# Altium schematic sheet ГРЛМ.468332.031Э3 (Лист 1).SchDoc: Наименование
size 420 x 297 mm; ApprovedBy: Утвердил; CheckedBy: Проверил; Author: Соколов; DocumentNumber: ГРЛМ.468332.031Э3; Revision: 0; SheetNumber: 1; SheetTotal: 3; PageSetup: Record=PageOptions|CenterHorizontal=True|CenterVertical=True|PrintScale=0.94|XCorrection=1.00|YCorrection=1.00|PrintKind=1|BorderSize=5000000|LeftOffset=0|BottomOffset=0|Orientation=1|PaperLength=1000|PaperWidth=1000|Scale=100|PaperSource=7|PrintQuality=-4|MediaType=1|DitherType=10|PaperKind=A4|PrintScaleMode=1; HeadOfSector: Нач. сектора; MainDevice: Перв.примен.; n_kontr: Н. контр; t_kontr: Т. Контр; lit_A: О; Наименование изделия (строка 1): Узел печатный; Наименование изделия (строка 2): R 6 DSX 04 M; Вид документа: Схема электрическая принципиальная; ListStatus: Нов.; Перв. примен.: ГРЛМ.468332.031; FileName: ГРЛМ.468332.031Э3.pdf; DocumentName: Sheet1.SCHDOC
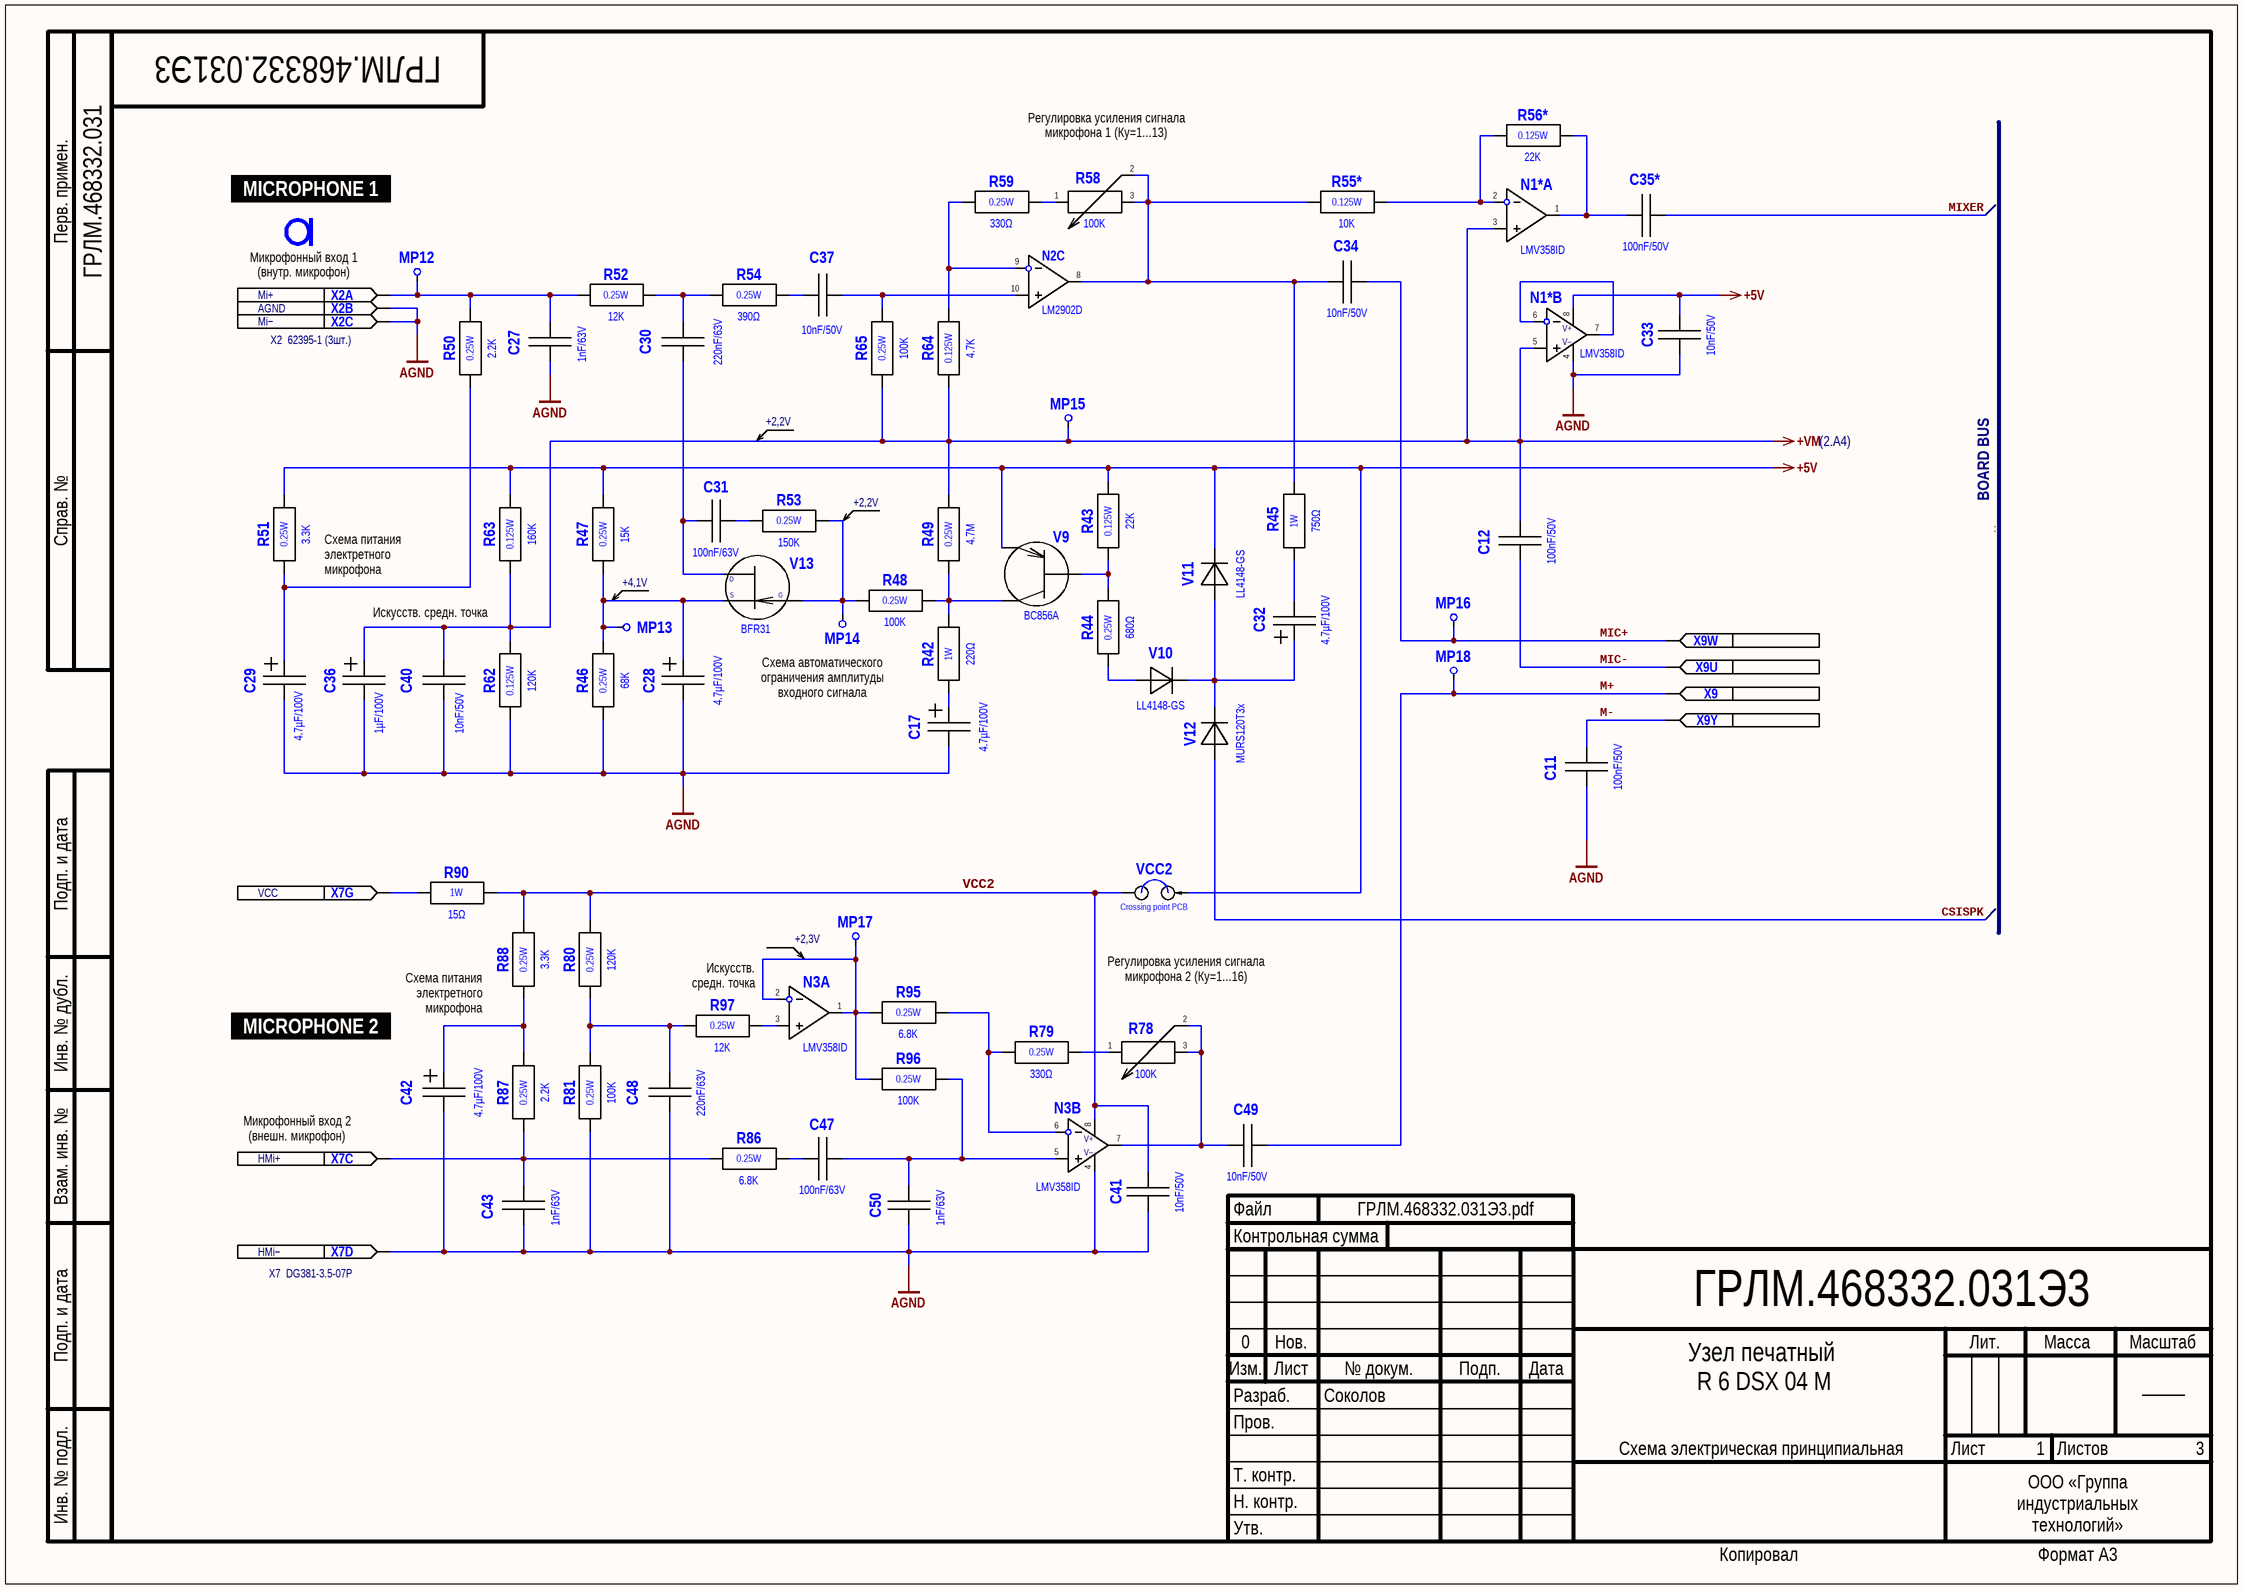
[diagram p0: ГРЛМ.468332.031Э3 (Лист 1).SchDoc]

## Parts
(Parts that share a designator on the sheet are numbered #1, #2 ... from top to bottom, then left to right.)
?#1  (no value)  (graphical)
?#2  (no value)  (graphical)
?#3  (no value)  (graphical)
?#4  (no value)  (graphical)
C11  100nF/50V  [SMD Capacitor 0805]
C12  100nF/50V  [SMD Capacitor 0805]
C17  4.7µF/100V  [Capacitor  electrolytic 5x11mm]
C27  1nF/63V  [SMD Capacitor 0805]
C28  4.7µF/100V  [Capacitor  electrolytic 5x11mm]
C29  4.7µF/100V  [Capacitor  electrolytic 5x11mm]
C30  220nF/63V  [SMD Capacitor 0805]
C31  100nF/63V  [SMD Capacitor 0805]
C32  4.7µF/100V  [Capacitor  electrolytic 5x11mm]
C33  10nF/50V  [SMD Capacitor 0805]
C34  10nF/50V  [SMD Capacitor 0805]
C35*  100nF/50V  [SMD Capacitor 0805]
C36  1µF/100V  [Capacitor  electrolytic 5x11mm]
C37  10nF/50V  [SMD Capacitor 0805]
C40  10nF/50V  [SMD Capacitor 0805]
C41  10nF/50V  [SMD Capacitor 0805]
C42  4.7µF/100V  [Capacitor  electrolytic 5x11mm]
C43  1nF/63V  [SMD Capacitor 0805]
C47  100nF/63V  [SMD Capacitor 0805]
C48  220nF/63V  [SMD Capacitor 0805]
C49  10nF/50V  [SMD Capacitor 0805]
C50  1nF/63V  [SMD Capacitor 0805]
MP12  TestPoint SMD  [Test point SMD]  (value not drawn)
MP13  TestPoint SMD  [Test point SMD]  (value not drawn)
MP14  TestPoint SMD  [Test point SMD]  (value not drawn)
MP15  TestPoint SMD  [Test point SMD]  (value not drawn)
MP16  TestPoint SMD  [Test point SMD]  (value not drawn)
MP17  TestPoint SMD  [Test point SMD]  (value not drawn)
MP18  TestPoint SMD  [Test point SMD]  (value not drawn)
N1*  LMV358ID  [SO8 (SOIC-8)]  (parts A,B of 2)
N2  LM2902D  [SO14]  (part C of 4)
N3  LMV358ID  [SO8 (SOIC-8)]  (parts A,B of 2)
R42  220Ω  Power dissipation: 1W  [Resistor FMP100 1W Yageo]
R43  22K  Power dissipation: 0.125W  [SMD Resistor 0805]
R44  680Ω  Power dissipation: 0.25W  [SMD Resistor 1206]
R45  750Ω  Power dissipation: 1W  [Resistor FMP100 1W Yageo]
R46  68K  Power dissipation: 0.25W  [SMD Resistor 1206]
R47  15K  Power dissipation: 0.25W  [SMD Resistor 1206]
R48  100K  Power dissipation: 0.25W  [SMD Resistor 1206]
R49  4.7M  Power dissipation: 0.25W  [SMD Resistor 1206]
R50  2.2K  Power dissipation: 0.25W  [SMD Resistor 1206]
R51  3.3K  Power dissipation: 0.25W  [SMD Resistor 1206]
R52  12K  Power dissipation: 0.25W  [SMD Resistor 1206]
R53  150K  Power dissipation: 0.25W  [SMD Resistor 1206]
R54  390Ω  Power dissipation: 0.25W  [SMD Resistor 1206]
R55*  10K  Power dissipation: 0.125W  [SMD Resistor 0805]
R56*  22K  Power dissipation: 0.125W  [SMD Resistor 0805]
R58  100K  [3362H Square Trimming Potentiometer]
R59  330Ω  Power dissipation: 0.25W  [SMD Resistor 1206]
R62  120K  Power dissipation: 0.125W  [SMD Resistor 0805]
R63  160K  Power dissipation: 0.125W  [SMD Resistor 0805]
R64  4.7K  Power dissipation: 0.125W  [SMD Resistor 0805]
R65  100K  Power dissipation: 0.25W  [SMD Resistor 1206]
R78  100K  [3362H Square Trimming Potentiometer]
R79  330Ω  Power dissipation: 0.25W  [SMD Resistor 1206]
R80  120K  Power dissipation: 0.25W  [SMD Resistor 1206]
R81  100K  Power dissipation: 0.25W  [SMD Resistor 1206]
R86  6.8K  Power dissipation: 0.25W  [SMD Resistor 1206]
R87  2.2K  Power dissipation: 0.25W  [SMD Resistor 1206]
R88  3.3K  Power dissipation: 0.25W  [SMD Resistor 1206]
R90  15Ω  Power dissipation: 1W  [Resistor FMP100 1W Yageo]
R95  6.8K  Power dissipation: 0.25W  [SMD Resistor 1206]
R96  100K  Power dissipation: 0.25W  [SMD Resistor 1206]
R97  12K  Power dissipation: 0.25W  [SMD Resistor 1206]
V9  BC856A  [Transistor BC856 SOT23 (PNP transistor)]
V10  LL4148-GS  [Diode SOD80C (Anode pin 1)]
V11  LL4148-GS  [Diode SOD80C (Anode pin 1)]
V12  MURS120T3x  [Diode SMB (DO-214AA)]
V13  BFR31  [Transistor BFR31 SOT23 (FET N-channel)]
VCC2  Crossing point PCB  [Crossing point PCB]
X2  62395-1 (3ps)  [Faston Connector 3 x 2.8 mm]  (value not drawn)  (parts A,B,C of 3)
X7  DG381-3.5-07P  [DG381-3.5-07P Terminals]  (value not drawn)  (parts C,D,G of 7)
X9  5177983-2  [Connector 5177983-2]  (value not drawn)  (parts U,W,Y,27 of 60)

## Nets
+5V: C33.2 N1*.8 R43.2 R47.2 R51.2 R63.2 V9.2(Emitter) V11.2 VCC2.1
+VM: C12.2 C36.1 C40.2 MP15.1 N1*.3 N1*.5 R49.2 R62.2 R63.1 R64.1 R65.1
AGND: C11.1 C17.2 C27.1 C28.2 C29.2 C33.1 C36.2 C40.1 C41.1 C42.2 C43.1 C48.1 C50.1 N1*.4 N3.4 R46.1 R62.1 R81.1 X2.2 X2.3 X7.4
CSISPK: V12.1
M+: C49.2 MP18.1 X9.27
M-: C11.2 X9.25
MIC+: C34.2 MP16.1 X9.23
MIC-: C12.1 X9.21
MIXER: C35*.2
VCC2: C41.2 N3.8 R80.2 R88.2 R90.2 VCC2.2
NetC17_1: C17.1 R42.1
NetC27_2: C27.2 MP12.1 R50.2 R52.1 X2.1
NetC28_1: C28.1 MP13.1 R46.2 R47.1 V13.2(Source)
NetC29_1: C29.1 R50.1 R51.1
NetC30_1: C30.1 C31.2 V13.1(Drain)
NetC30_2: C30.2 R52.2 R54.1
NetC31_1: C31.1 R53.1
NetC32_1: C32.1 V10.2 V11.1 V12.2
NetC32_2: C32.2 R45.2
NetC34_1: C34.1 N2.8 R45.1 R55*.1 R58.2 R58.3
NetC35*_1: C35*.1 N1*.1 R56*.2
NetC37_1: C37.1 R54.2
NetC37_2: C37.2 N2.10 R65.2
NetC42_1: C42.1 R87.2 R88.1
NetC43_2: C43.2 R86.1 R87.1 X7.3
NetC47_1: C47.1 C50.2 N3.5 R96.2
NetC47_2: C47.2 R86.2
NetC48_2: C48.2 R80.1 R81.2 R97.1
NetC49_1: C49.1 N3.7 R78.2 R78.3
NetMP14_1: MP14.1 R48.1 R53.2 V13.3(Gate)
NetMP17_1: MP17.1 N3.1 N3.2 R95.1 R96.1
NetN1*_2: N1*.2 R55*.2 R56*.1
NetN1*_6: N1*.6 N1*.7
NetN2_9: N2.9 R59.1 R64.2
NetN3_3: N3.3 R97.2
NetN3_6: N3.6 R79.1 R95.2
NetR42_2: R42.2 R48.2 R49.1 V9.3(Collector)
NetR43_1: R43.1 R44.2 V9.1(Base)
NetR44_1: R44.1 V10.1
NetR58_1: R58.1 R59.2
NetR78_1: R78.1 R79.2
NetR90_1: R90.1 X7.7

## Buses and harness runs
bus ..

## Notes on the sheet
- (near R58) Регулировка усиления сигнала микрофона 1 (Ку=1...13)
- MICROPHONE 1
- (near X2) Микрофонный вход 1
  (внутр. микрофон)
- Mi+
- AGND
- Mi−
- (near X2) X2  62395-1 (3шт.)
- +2,2V
- (2.A4)
- BOARD BUS
- (near R53) +2,2V
- (near R51) Схема питания электретного микрофона
- +4,1V
- Искусств. средн. точка
- Схема автоматического ограничения амплитуды входного сигнала
- VCC
- Искусств.
  средн. точка
- +2,3V
- MICROPHONE 2
- Схема питания электретного микрофона
- (near R78) Регулировка усиления сигнала микрофона 2 (Ку=1...16)
- (near X7) Микрофонный вход 2
  (внешн. микрофон)
- HMi+
- HMi−
- (near X7) X7  DG381-3.5-07P
- Перв. примен.
- Справ. №
- Подп. и дата
- Инв. № дубл.
- Взам. инв. №
- Файл
- Контрольная сумма
- Лит.
- Масса
- Масштаб
- Разраб.
- Изм.
- Лист
- № докум.
- Подп.
- Дата
- Инв. № подл.
- Пров.
- Т. контр.
- Листов
- Н. контр.
- Утв.
- ООО «Группа индустриальных технологий»
- Копировал
- Формат А3
- (in symbol LMV358D, part B) V+; V–
- (in symbol Transistor FET N-channel) D; S; G

## Library data of the parts
?#1 = Штамп с развернутым обозначением документа
?#2 = Штамп с применяемостью
?#3 = Левый нижний угловой штамп
?#4 = Основная надпись первого листа
C11 C12 C35* = Capacitor: Partnumber: CC0805KRX7R9BB104; Vendor: Yageo; Type: Конденсатор керамический 100 нФ 5% 50В SMD 0805
C17 C28 C29 C32 C42 = Capacitor Electrolytic: Partnumber: К50-35-100В-4,7мкФ 5х11мм; Type: Конденсатор электролитический 4,7 мкФ ±20% 100В
C27 C43 C50 = Capacitor: Partnumber: CC0805JRNPO0BN102; Vendor: Yageo; Type: Конденсатор керамический 1нФ 5% 100В COG SMD 0805
C30 C48 = Capacitor: Partnumber: GRM31MR72A224KA01L; Vendor: Murata; Type: Конденсатор керамический 220 нФ 10% 100В X7R SMD 1206
C31 = Capacitor: Partnumber: CC0805KRX7R9BB104; Vendor: Yageo; Type: Конденсатор керамический 100 нФ 10% 100В X7R SMD 1206
C33 C34 C37 C40 C41 C49 = Capacitor: Partnumber: CC0805KRX7R9BB103; Vendor: Yageo; Type: Конденсатор керамический 10 нФ 5% 50В SMD 0805
C36 = Capacitor Electrolytic: Partnumber: К50-35-100В-1мкФ 5х11мм; Type: Конденсатор электролитический 1 мкФ ±20% 100В
C47 = Capacitor: Partnumber: CC1206KKX7R0BB104; Vendor: Yageo; Type: Конденсатор керамический 100 нФ 10% 100В X7R SMD 1206
MP12-MP18 = TestPoint SMD: SMD Test Point
N1* N3 = LMV358D: Low-power dual operational amplifiers / SO-14; Vendor: TI; ComponentLink1URL: \STM32F429.pdf; Type: Операционный усилитель сдвоенный; Package: SOIC8; Partnumber: LMV358ID
N2 = LM2902D(DT): Low-power quad operational amplifiers / SO-14; Vendor: NXP; ComponentLink1URL: \STM32F429.pdf; Type: Операционный усилитель LM2902; Package: SOIC14; Partnumber: LM2902D(DT)
R42 = Resistor: Partnumber: FMP100JR-52-220R; Vendor: Yageo; Type: Резистор металлоплёночный 221 Ом 1% 1Вт
R43 R56* = Resistor: Partnumber: RC0805JR-0722KL; Vendor: Yageo; Type: Резистор 22 кОм 5% 0,125Вт SMD 0805
R44 = Resistor: Partnumber: RC1206JR-07680RL; Vendor: Yageo; Type: Резистор 680 Ом 5% 0,25Вт SMD 1206
R45 = Resistor: Partnumber: FMP100JR-52-750R; Vendor: Yageo; Type: Резистор металлоплёночный 750 Ом 1% 1Вт
R46 = Resistor: Partnumber: RC1206JR-0768KL; Vendor: Yageo; Type: Резистор 68 кОм 5% 0,25Вт SMD 1206
R47 = Resistor: Partnumber: RC1206JR-0715KL; Vendor: Yageo; Type: Резистор 15 кОм 5% 0,25Вт SMD 1206
R48 R65 R81 R96 = Resistor: Partnumber: RC1206JR-07100KL; Vendor: Yageo; Type: Резистор 100 кОм 5% 0,25Вт SMD 1206
R49 = Resistor: Partnumber: RC1206JR-074M7L; Vendor: Yageo; Type: Резистор 4,7 МОм 5% 0,25Вт SMD 1206
R50 R87 = Resistor: Partnumber: RC1206JR-072K2L; Vendor: Yageo; Type: Резистор 2.2 кОм 5% 0,25Вт SMD 1206
R51 R88 = Resistor: Partnumber: RC1206JR-073K3L; Vendor: Yageo; Type: Резистор 3,3 кОм 5% 0,25Вт SMD 1206
R52 R97 = Resistor: Partnumber: RC1206JR-0712KL; Vendor: Yageo; Type: Резистор 12 кОм 5% 0,25Вт SMD 1206
R53 = Resistor: Partnumber: RC1206JR-07150KL; Vendor: Yageo; Type: Резистор 150 кОм 5% 0,25Вт SMD 1206
R54 = Resistor: Partnumber: RC1206JR-07390RL; Vendor: Yageo; Type: Резистор 390 Ом 5% 0,25Вт SMD 1206
R55* = Resistor: Partnumber: RC0805JR-0710KL; Vendor: Yageo; Type: Резистор 10 кОм 5% 0,125Вт SMD 0805
R58 R78 = Resistor adjustable: Partnumber: 3362H-1-104LF; Vendor: Bourns; Type: Резистор подстроечный
R59 R79 = Resistor: Partnumber: RC1206JR-07330RL; Vendor: Yageo; Type: Резистор 330 Ом 5% 0,25Вт SMD 1206
R62 = Resistor: Partnumber: RC0805FR-07120KL; Vendor: Yageo; Type: Резистор 120 кОм 1% 0,125Вт SMD 0805
R63 = Resistor: Partnumber: RC0805FR-07160KL; Vendor: Yageo; Type: Резистор 160 кОм 1% 0,125Вт SMD 0805
R64 = Resistor: Partnumber: RC0805JR-074K7L; Vendor: Yageo; Type: 0.125Вт 0805 4.7 кОм, 5%, Чип резистор (SMD)
R80 = Resistor: Partnumber: RC1206JR-07120KL; Vendor: Yageo; Type: Резистор 120 кОм 5% 0,25Вт SMD 1206
R86 R95 = Resistor: Partnumber: RC1206JR-076K8L; Vendor: Yageo; Type: Резистор 6,8 кОм 5% 0,25Вт SMD 1206
R90 = Resistor: Partnumber: FMP100JT-52-15R; Vendor: Yageo; Type: Резистор металлоплёночный 15 Ом 5% 1Вт
V9 = Transistor PNP: Base - 1, Emitter - 2, Collector - 3; Vendor: Philips; Type: Транзистор BC856A SMD SOT23; Partnumber: BC856A
V10 V11 = Diode: LL4148-GS MELF Package; Partnumber: LL4148-GSxx; Vendor: Vishay; Package: MiniMELF Glass case (SOD80); Type: Small Signal Fast Switching Diode
V12 = Diode: LL4148-GS MELF Package; Vendor: ON Semiconductor; Package: SMB (DO−214AA); Type: ULTRAFAST POWER RECTIFIER; Partnumber: MURS120T3x
V13 = Transistor FET N-channel: Drain - 1, Source - 2, Gate - 3; Vendor: Philips; Type: Транзистор N-канальный полевой SMD SOT23; Partnumber: BFR31
VCC2 = Crossing point PCB: Crossing point
X2 = Connector 3 pins (universal): Vendor: TE Connectivity; Type: FASTON-110, 3-поз., ширина лезвия: 2,8mm; Partnumber: 62395-1 (3 ps)
X7 = Connector 7 pins (universal): Vendor: Degson; Type: Соединитель клеммный винтовой 7 полюсов; Partnumber: DG381-3.5-07P
X9 = Connector 60 pins (universal): Vendor: TE; Type: Соединитель 60 полюсов; Partnumber: 5177983-2